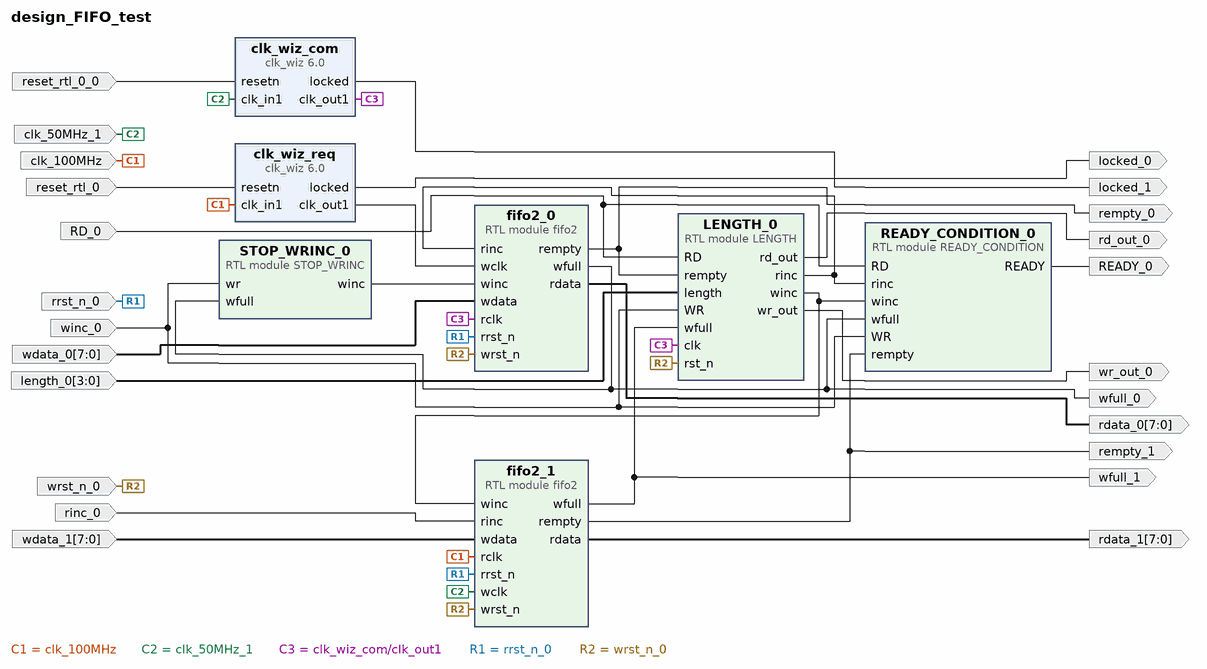
[diagram p0: block diagram of the top level]
# Vivado block design design_FIFO_test, xc7a12ticsg325-1L, Vivado 2025.2
create_bd_design design_FIFO_test

create_bd_port -dir I -from 7 -to 0 wdata_0
create_bd_port -dir I winc_0
create_bd_port -dir I wrst_n_0
create_bd_port -dir I rrst_n_0
create_bd_port -dir O -from 7 -to 0 rdata_0
create_bd_port -dir O wfull_0
create_bd_port -dir O rempty_0
create_bd_port -dir I -type clk clk_100MHz
set_property -dict {CONFIG.FREQ_HZ 100000000} [get_bd_ports clk_100MHz]
create_bd_port -dir I -type rst reset_rtl_0
set_property -dict {CONFIG.POLARITY ACTIVE_LOW} [get_bd_ports reset_rtl_0]
create_bd_port -dir I -type clk clk_50MHz_1
set_property -dict {CONFIG.FREQ_HZ 100000000} [get_bd_ports clk_50MHz_1]
create_bd_port -dir I -type rst reset_rtl_0_0
set_property -dict {CONFIG.POLARITY ACTIVE_LOW} [get_bd_ports reset_rtl_0_0]
create_bd_port -dir O locked_0
create_bd_port -dir O locked_1
create_bd_port -dir I RD_0
create_bd_port -dir I -from 3 -to 0 length_0
create_bd_port -dir O rd_out_0
create_bd_port -dir O wr_out_0
create_bd_port -dir O READY_0
create_bd_port -dir I -from 7 -to 0 wdata_1
create_bd_port -dir I rinc_0
create_bd_port -dir O -from 7 -to 0 rdata_1
create_bd_port -dir O wfull_1
create_bd_port -dir O rempty_1

create_bd_cell -type module -reference fifo2 fifo2_0
create_bd_cell -type ip -vlnv xilinx.com:ip:clk_wiz:6.0 clk_wiz_req
set_property -dict {CONFIG.RESET_PORT resetn CONFIG.RESET_TYPE ACTIVE_LOW} [get_bd_cells clk_wiz_req]
create_bd_cell -type ip -vlnv xilinx.com:ip:clk_wiz:6.0 clk_wiz_com
set_property -dict [list \
  CONFIG.CLKOUT1_JITTER 130.958 \
  CONFIG.CLKOUT1_REQUESTED_OUT_FREQ 100 \
  CONFIG.MMCM_CLKOUT0_DIVIDE_F 10.000 \
  CONFIG.RESET_PORT resetn \
  CONFIG.RESET_TYPE ACTIVE_LOW \
] [get_bd_cells clk_wiz_com]
create_bd_cell -type module -reference LENGTH LENGTH_0
create_bd_cell -type module -reference READY_CONDITION READY_CONDITION_0
create_bd_cell -type module -reference STOP_WRINC STOP_WRINC_0
create_bd_cell -type module -reference fifo2 fifo2_1

# ---- connections ----

connect_bd_net [get_bd_pins LENGTH_0/rd_out] [get_bd_ports rd_out_0]
connect_bd_net [get_bd_pins LENGTH_0/rinc] [get_bd_pins fifo2_0/rinc] [get_bd_pins READY_CONDITION_0/rinc]
connect_bd_net [get_bd_pins LENGTH_0/winc] [get_bd_pins fifo2_1/winc] [get_bd_pins READY_CONDITION_0/winc]
connect_bd_net [get_bd_pins LENGTH_0/wr_out] [get_bd_ports wr_out_0]
connect_bd_net -net RD_0_1 [get_bd_ports RD_0] [get_bd_pins READY_CONDITION_0/RD] [get_bd_pins LENGTH_0/RD]
connect_bd_net [get_bd_pins READY_CONDITION_0/READY] [get_bd_ports READY_0]
connect_bd_net [get_bd_pins STOP_WRINC_0/winc] [get_bd_pins fifo2_0/winc]
connect_bd_net [get_bd_ports clk_100MHz] [get_bd_pins clk_wiz_req/clk_in1] [get_bd_pins fifo2_1/rclk]
connect_bd_net -net clk_100MHz_1_1 [get_bd_ports clk_50MHz_1] [get_bd_pins clk_wiz_com/clk_in1] [get_bd_pins fifo2_1/wclk]
connect_bd_net [get_bd_pins clk_wiz_com/clk_out1] [get_bd_pins fifo2_0/rclk] [get_bd_pins LENGTH_0/clk]
connect_bd_net [get_bd_pins clk_wiz_com/locked] [get_bd_ports locked_1]
connect_bd_net [get_bd_pins clk_wiz_req/clk_out1] [get_bd_pins fifo2_0/wclk]
connect_bd_net [get_bd_pins clk_wiz_req/locked] [get_bd_ports locked_0]
connect_bd_net [get_bd_pins fifo2_0/rdata] [get_bd_ports rdata_0]
connect_bd_net [get_bd_pins fifo2_0/rempty] [get_bd_ports rempty_0] [get_bd_pins LENGTH_0/rempty]
connect_bd_net [get_bd_pins fifo2_0/wfull] [get_bd_ports wfull_0] [get_bd_pins STOP_WRINC_0/wfull] [get_bd_pins READY_CONDITION_0/wfull]
connect_bd_net [get_bd_pins fifo2_1/rdata] [get_bd_ports rdata_1]
connect_bd_net [get_bd_pins fifo2_1/rempty] [get_bd_ports rempty_1] [get_bd_pins READY_CONDITION_0/rempty]
connect_bd_net [get_bd_pins fifo2_1/wfull] [get_bd_ports wfull_1] [get_bd_pins LENGTH_0/wfull]
connect_bd_net -net length_0_1 [get_bd_ports length_0] [get_bd_pins LENGTH_0/length]
connect_bd_net -net reset_rtl_0_0_1 [get_bd_ports reset_rtl_0_0] [get_bd_pins clk_wiz_com/resetn]
connect_bd_net -net reset_rtl_0_1 [get_bd_ports reset_rtl_0] [get_bd_pins clk_wiz_req/resetn]
connect_bd_net -net rinc_0_1 [get_bd_ports rinc_0] [get_bd_pins fifo2_1/rinc]
connect_bd_net -net rrst_n_0_1 [get_bd_ports rrst_n_0] [get_bd_pins fifo2_0/rrst_n] [get_bd_pins fifo2_1/rrst_n]
connect_bd_net -net wdata_0_1 [get_bd_ports wdata_0] [get_bd_pins fifo2_0/wdata]
connect_bd_net -net wdata_1_1 [get_bd_ports wdata_1] [get_bd_pins fifo2_1/wdata]
connect_bd_net -net winc_0_1 [get_bd_ports winc_0] [get_bd_pins STOP_WRINC_0/wr] [get_bd_pins READY_CONDITION_0/WR] [get_bd_pins LENGTH_0/WR]
connect_bd_net -net wrst_n_0_1 [get_bd_ports wrst_n_0] [get_bd_pins fifo2_0/wrst_n] [get_bd_pins fifo2_1/wrst_n] [get_bd_pins LENGTH_0/rst_n]

validate_bd_design
save_bd_design
